# EAGLE design razniffer (EAGLE 6.6.0)
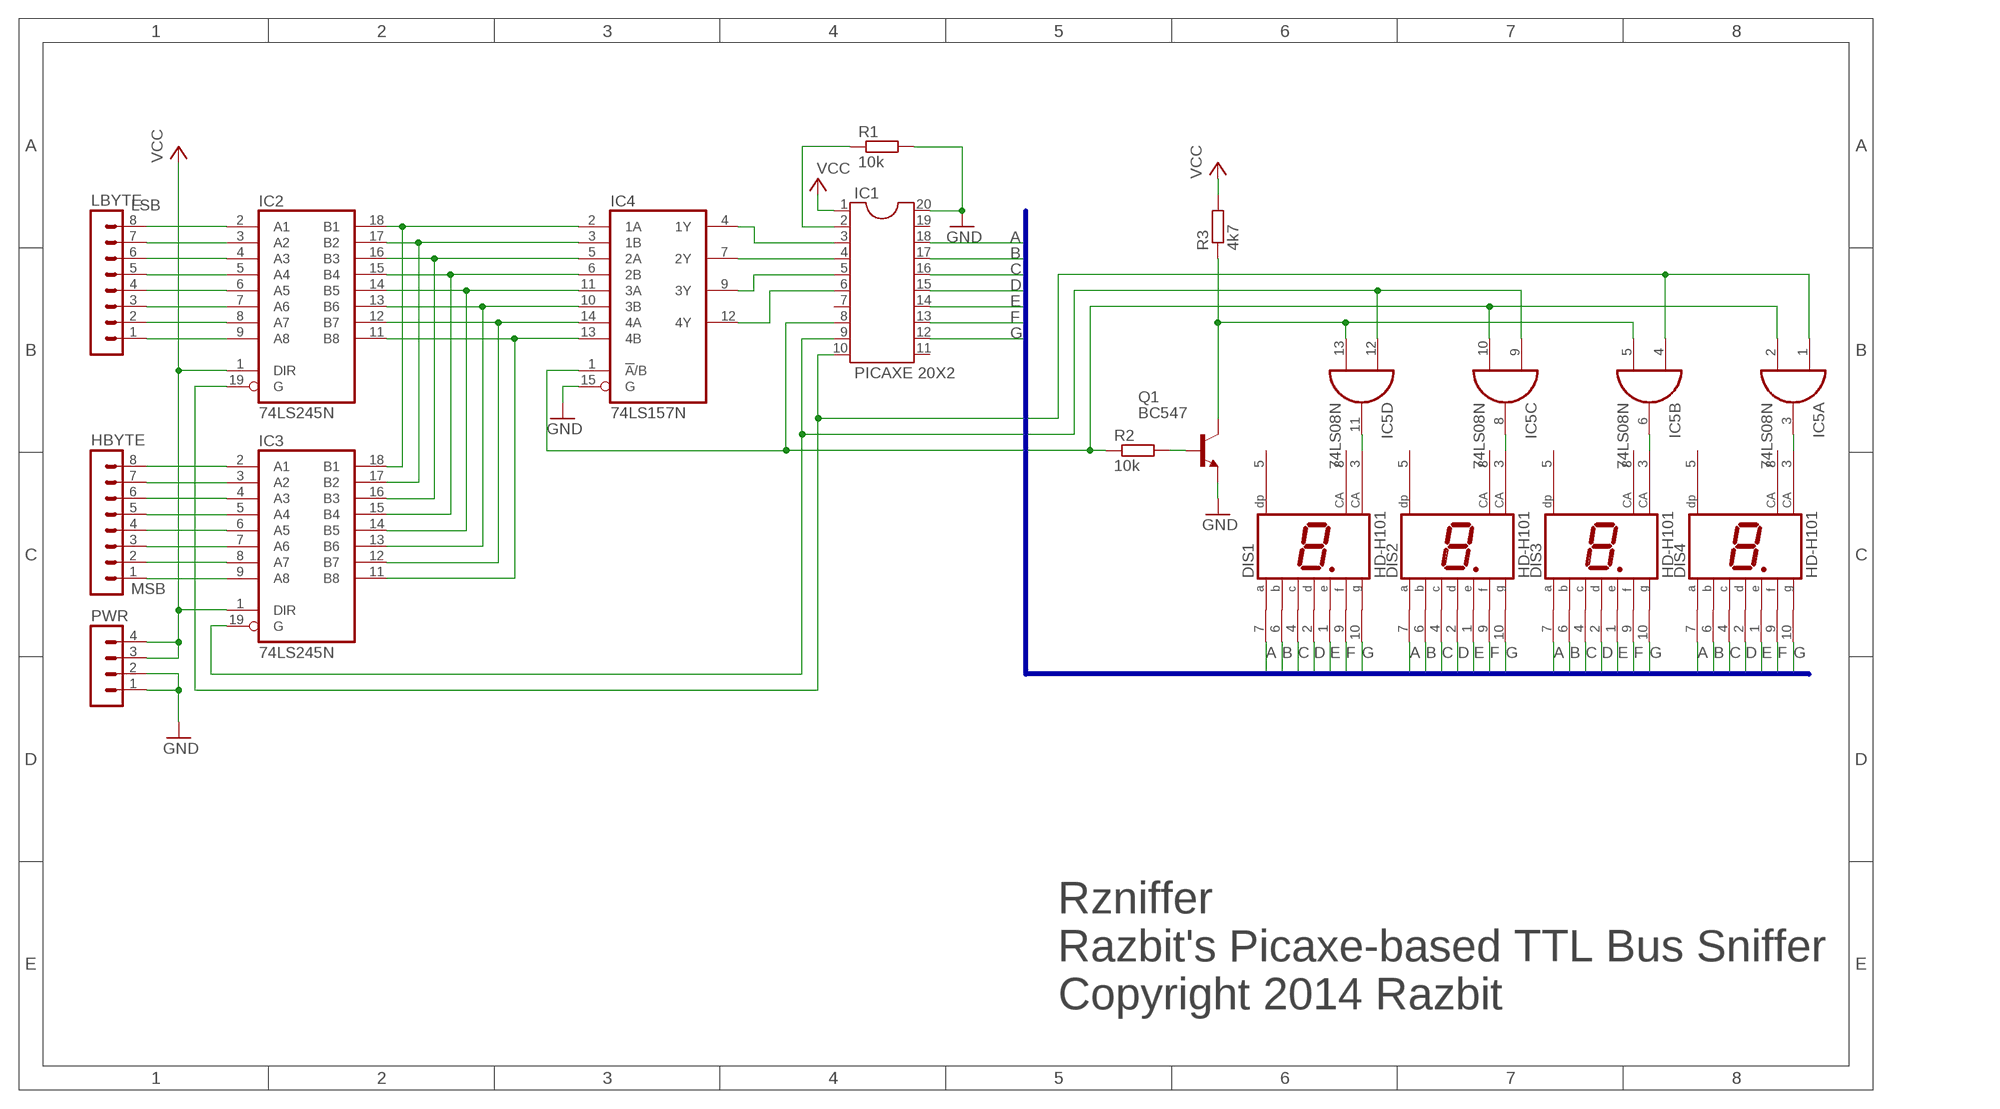
[diagram p0: schematic, sheet 1]

## Parts
DIS1  HD-H101  [HDSP-M]
DIS2  HD-H101  [HDSP-M]
DIS3  HD-H101  [HDSP-M]
DIS4  HD-H101  [HDSP-M]
HBYTE  MA08-1  [MA08-1]
IC1  PICAXE 20X2  DIL20  [DIL20]
IC2  74LS245N  [DIL20]
IC3  74LS245N  [DIL20]
IC4  74LS157N  [DIL16]
IC5  74LS08N  [DIL14]
LBYTE  MA08-1  [MA08-1]
PWR  MA04-1  [MA04-1]
Q1  BC547  [TO92]
R1  10k  R-EU_0204/7  [0204/7]
R2  10k  R-EU_0204/7  [0204/7]
R3  4k7  R-EU_0204/7  [0204/7]

## Nets
A: DIS1.7(A) DIS2.7(A) DIS3.7(A) DIS4.7(A) IC1.18
B: DIS1.6(B) DIS2.6(B) DIS3.6(B) DIS4.6(B) IC1.17
C: DIS1.4(C) DIS2.4(C) DIS3.4(C) DIS4.4(C) IC1.16
D: DIS1.2(D) DIS2.2(D) DIS3.2(D) DIS4.2(D) IC1.15
E: DIS1.1(E) DIS2.1(E) DIS3.1(E) DIS4.1(E) IC1.14
F: DIS1.9(F) DIS2.9(F) DIS3.9(F) DIS4.9(F) IC1.13
G: DIS1.10(G) DIS2.10(G) DIS3.10(G) DIS4.10(G) IC1.12
GND: IC1.20 IC4.15(G) PWR.1 PWR.2 Q1.1(E) R1.2
N$1: IC2.2(A1) LBYTE.8
N$2: IC2.3(A2) LBYTE.7
N$3: IC2.4(A3) LBYTE.6
N$4: IC2.5(A4) LBYTE.5
N$5: IC2.6(A5) LBYTE.4
N$6: IC2.7(A6) LBYTE.3
N$7: IC2.8(A7) LBYTE.2
N$8: IC2.9(A8) LBYTE.1
N$9: HBYTE.8 IC3.2(A1)
N$10: HBYTE.7 IC3.3(A2)
N$11: HBYTE.6 IC3.4(A3)
N$12: HBYTE.5 IC3.5(A4)
N$13: HBYTE.4 IC3.6(A5)
N$14: HBYTE.3 IC3.7(A6)
N$15: HBYTE.2 IC3.8(A7)
N$16: HBYTE.1 IC3.9(A8)
N$17: IC5.5(B:I1) IC5.13(D:I1) Q1.3(C) R3.1
N$18: IC2.18(B1) IC3.18(B1) IC4.2(1A)
N$19: IC2.17(B2) IC3.17(B2) IC4.3(1B)
N$20: IC2.16(B3) IC3.16(B3) IC4.5(2A)
N$21: IC2.15(B4) IC3.15(B4) IC4.6(2B)
N$22: IC2.14(B5) IC3.14(B5) IC4.11(3A)
N$23: IC2.13(B6) IC3.13(B6) IC4.10(3B)
N$24: IC2.12(B7) IC3.12(B7) IC4.14(4A)
N$25: IC2.11(B8) IC3.11(B8) IC4.13(4B)
N$26: Q1.2(B) R2.2
N$27: IC1.2 R1.1
N$28: IC1.3 IC4.4(1Y)
N$29: IC1.4 IC4.7(2Y)
N$30: IC1.5 IC4.9(3Y)
N$31: IC1.6 IC4.12(4Y)
N$32: IC1.10 IC2.19(G) IC5.1(A:I0) IC5.4(B:I0)
N$33: IC1.9 IC3.19(G) IC5.9(C:I0) IC5.12(D:I0)
N$34: IC1.8 IC4.1(!A!/B) IC5.2(A:I1) IC5.10(C:I1) R2.1
N$35: DIS1.3(CA) IC5.11(D:O)
N$36: DIS2.3(CA) IC5.8(C:O)
N$37: DIS3.3(CA) IC5.6(B:O)
N$38: DIS4.3(CA) IC5.3(A:O)
VCC: IC1.1 IC2.1(DIR) IC3.1(DIR) PWR.3 PWR.4 R3.2
Unconnected: DIS1.5(DP) DIS1.8(CA) DIS2.5(DP) DIS2.8(CA) DIS3.5(DP) DIS3.8(CA) DIS4.5(DP) DIS4.8(CA) IC1.7 IC1.11 IC1.19

## Buses
A,B,C,D,E,F,G

## Notes on the sheet
- LSB
- MSB
- Rzniffer
  Razbit's Picaxe-based TTL Bus Sniffer
  Copyright 2014 Razbit

## Power pins joined to a net without a drawn wire
GND: IC2.10(GND) IC3.10(GND) IC4.8(GND) IC5.7(P:GND)
VCC: IC2.20(VCC) IC3.20(VCC) IC4.16(VCC) IC5.14(P:VCC)

## Library data of the parts
DIS1-DIS4 = display-hp:HD-H101: LED DISPLAY 1-character 7 segment, decimal point right; OC_FARNELL: unknown; OC_NEWARK: unknown
HBYTE LBYTE = con-lstb:MA08-1: PIN HEADER; OC_FARNELL: unknown; OC_NEWARK: unknown
IC1 = ic-package:DIL20: Dual In Line / Socket
IC2 IC3 = 74xx-eu:74*245: Octal BUS TRANSCEIVER, 3-state
IC4 = 74xx-eu:74*157: Quadruple 2-line to 1-line data SELECTOR/MULTIPLEXER
IC5 = 74xx-eu:74*08: Quad 2-input AND gate
PWR = con-lstb:MA04-1: PIN HEADER; OC_FARNELL: unknown; OC_NEWARK: unknown
Q1 = transistor-npn:BC547*: NPN Transistor
R1-R3 = resistor:R-EU_: RESISTOR, European symbol

## Board
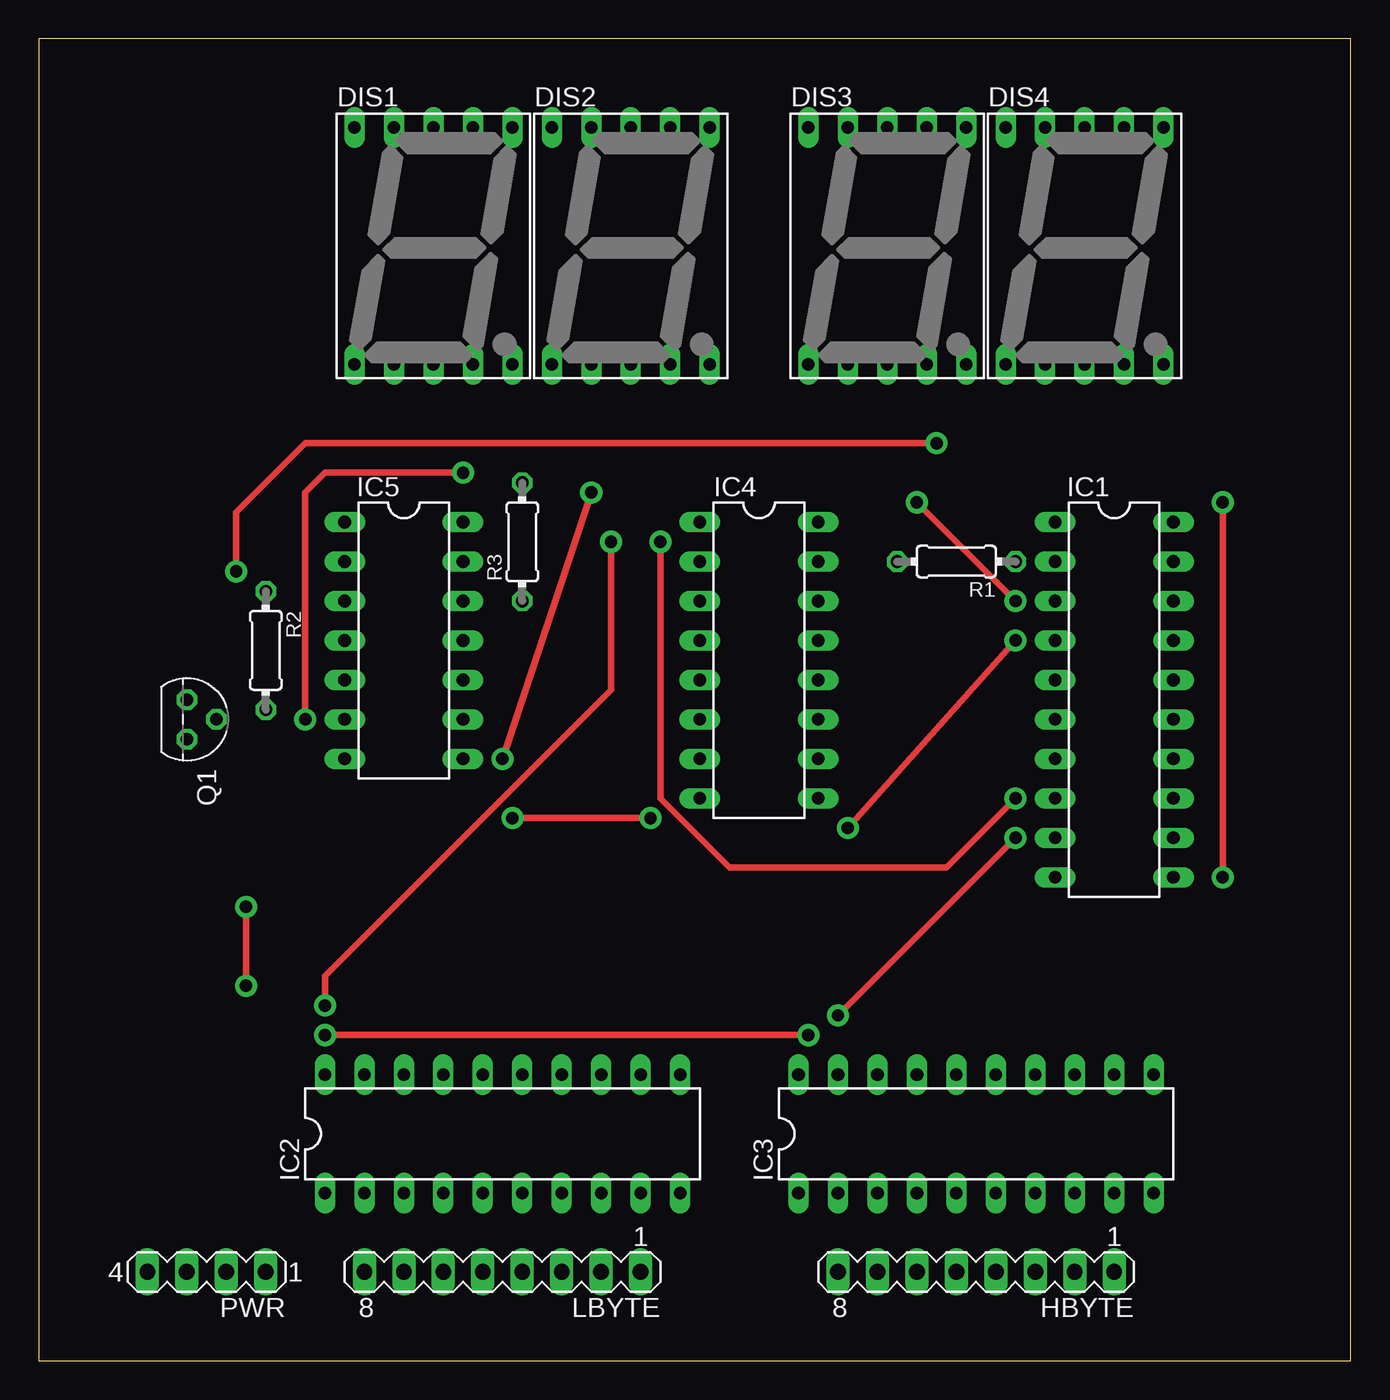
[diagram p1: board, top side]
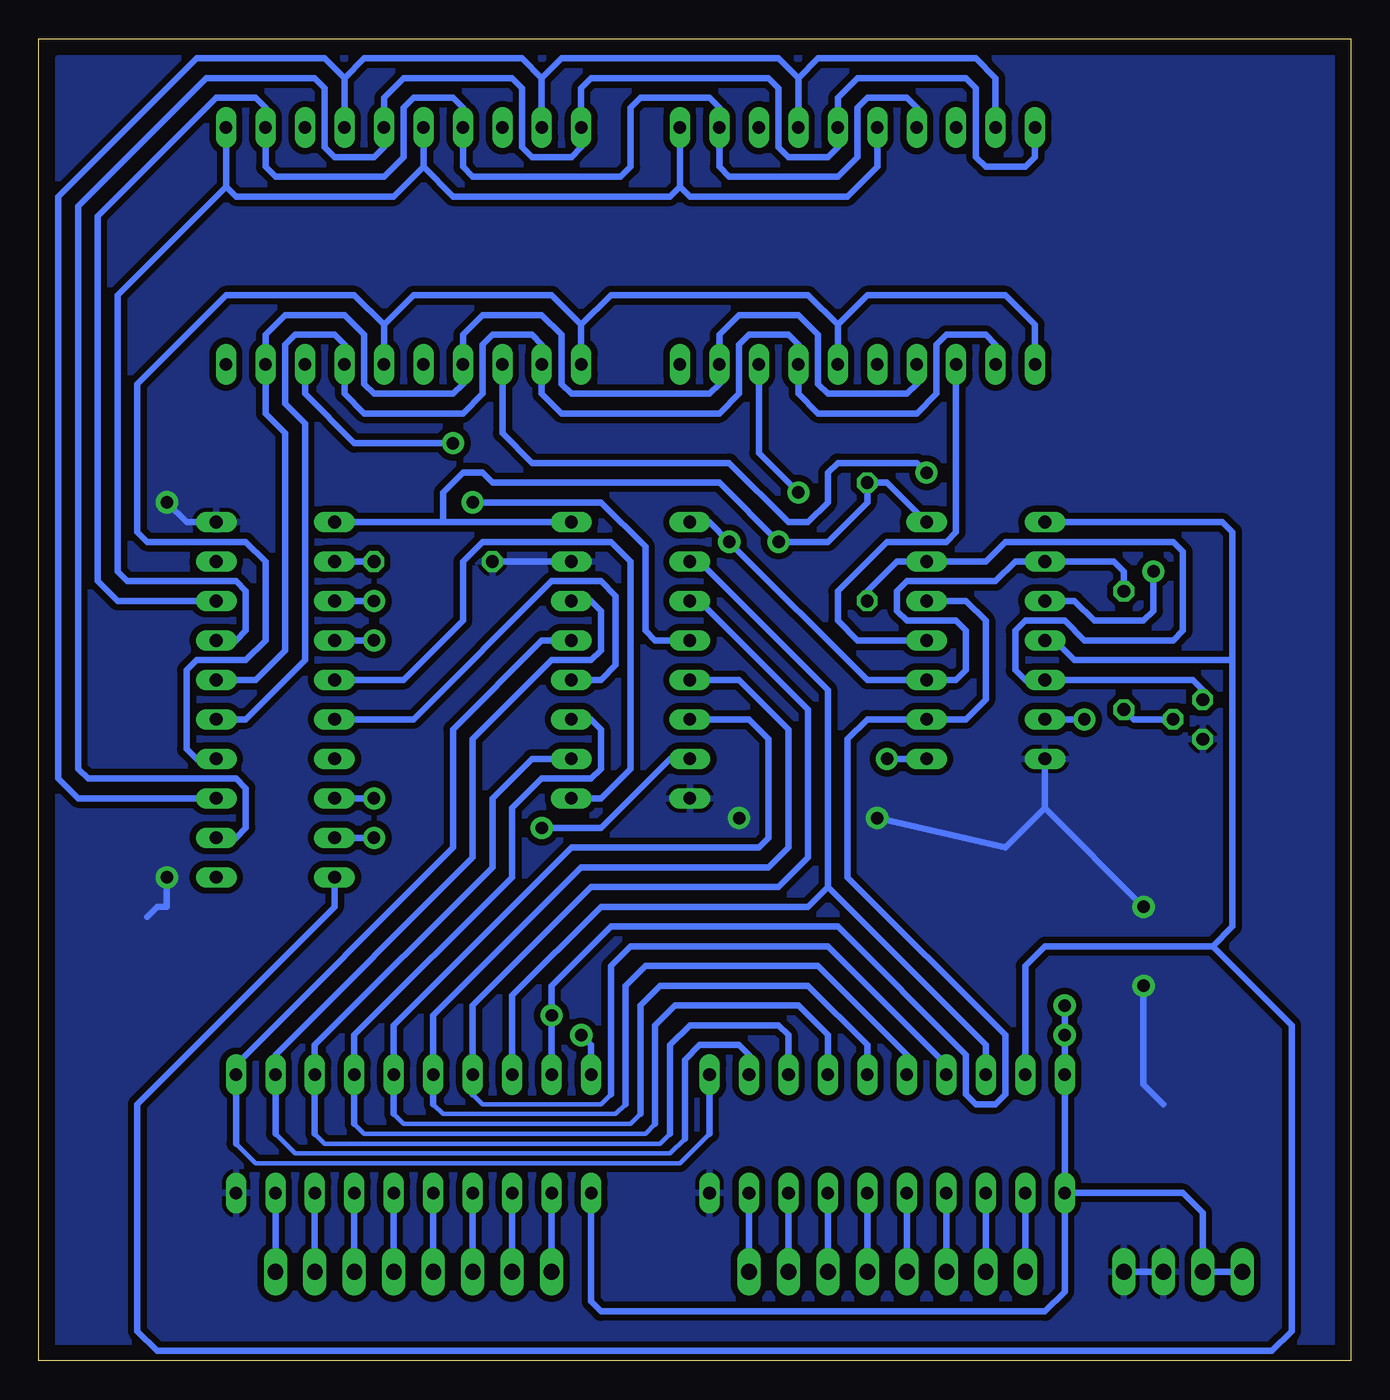
[diagram p2: board, bottom side, seen from below]

Size 84.44 x 85.08 mm. Coordinates in mm from the lower left corner, seen from the top.
Outline: 0,0 84.44,0 84.44,85.08 0,85.08 0,0
Copper layers (1*16): Top 0.035mm / dielectric 1.5mm / Bottom 0.035mm
Design rules "default": minimum track width 10mil, minimum drill 24mil, track to track 8mil, track to pad 8mil, pad to pad 8mil, via to via 8mil, smd to smd 8mil, copper to edge 40mil, drill to drill 8mil, minimum pad ring 10mil, minimum via ring 8mil, stop-mask expansion 4mil, vias tented up to drill 0mil, thermal gap 10mil

### Footprints (pad centres in the part's own frame; a part is rotated, then mirrored left to right if it is on the bottom)
HDSP-M = drill 0.813 long: 1 -5.08,-7.62; 2 -2.54,-7.62; 3 0,-7.62; 4 2.54,-7.62; 5 5.08,-7.62; 6 5.08,7.62; 7 2.54,7.62; 8 0,7.62; 9 -2.54,7.62; 10 -5.08,7.62
MA08-1 = drill 1.016 long: 1 -8.89,0; 2 -6.35,0; 3 -3.81,0; 4 -1.27,0; 5 1.27,0; 6 3.81,0; 7 6.35,0; 8 8.89,0
DIL20 = drill 0.813 long: 1 -11.43,-3.81; 2 -8.89,-3.81; 3 -6.35,-3.81; 4 -3.81,-3.81; 5 -1.27,-3.81; 6 1.27,-3.81; 7 3.81,-3.81; 8 6.35,-3.81; 9 8.89,-3.81; 10 11.43,-3.81; 11 11.43,3.81; 12 8.89,3.81; 13 6.35,3.81; 14 3.81,3.81; 15 1.27,3.81; 16 -1.27,3.81; 17 -3.81,3.81; 18 -6.35,3.81; 19 -8.89,3.81; 20 -11.43,3.81
DIL16 = drill 0.813 long: 1 -8.89,-3.81; 2 -6.35,-3.81; 3 -3.81,-3.81; 4 -1.27,-3.81; 5 1.27,-3.81; 6 3.81,-3.81; 7 6.35,-3.81; 8 8.89,-3.81; 9 8.89,3.81; 10 6.35,3.81; 11 3.81,3.81; 12 1.27,3.81; 13 -1.27,3.81; 14 -3.81,3.81; 15 -6.35,3.81; 16 -8.89,3.81
DIL14 = drill 0.813 long: 1 -7.62,-3.81; 2 -5.08,-3.81; 3 -2.54,-3.81; 4 0,-3.81; 5 2.54,-3.81; 6 5.08,-3.81; 7 7.62,-3.81; 8 7.62,3.81; 9 5.08,3.81; 10 2.54,3.81; 11 0,3.81; 12 -2.54,3.81; 13 -5.08,3.81; 14 -7.62,3.81
MA04-1 = drill 1.016 long: 1 -3.81,0; 2 -1.27,0; 3 1.27,0; 4 3.81,0
TO92 = drill 0.813 octagon: 1 1.27,0; 2 0,1.905; 3 -1.27,0
0204/7 = drill 0.813 octagon: 1 -3.81,0; 2 3.81,0

### Placement (x,y rotation side)
DIS1  25.4,71.76 0 top
DIS2  38.1,71.76 0 top
DIS3  54.61,71.76 0 top
DIS4  67.31,71.76 0 top
HBYTE  60.33,5.71 180 top
IC1  69.22,42.54 270 top
IC2  29.85,14.61 0 top
IC3  60.33,14.61 0 top
IC4  46.36,45.09 270 top
IC5  23.5,46.35 270 top
LBYTE  29.85,5.71 180 top
PWR  10.8,5.71 180 top
Q1  9.52,41.27 270 top
R1  59.05,51.43 180 top
R2  14.61,45.72 270 top
R3  31.11,52.7 90 top

### Tracks (layer width: path | path; a pad name or v marks a point on that pad's centre or on a via)
A
  Bottom 0.406: DIS1.7 27.94,80.65 28.57,81.28 31.11,81.28 31.75,80.65 31.75,77.47 33.02,76.2 40.01,76.2 40.64,76.84 DIS2.7 40.64,80.65 41.28,81.28 45.72,81.28 46.36,80.65 46.36,76.84 46.99,76.2 56.52,76.2 57.15,76.84 DIS3.7 57.15,80.65 57.79,81.28 60.33,81.28 60.96,80.65 60.96,77.47 62.23,76.2 69.22,76.2 69.85,76.84 DIS4.7 69.85,80.65 70.48,81.28 73.03,81.28 80.64,73.66 80.64,50.16 79.38,48.89 IC1.18
B
  Bottom 0.406: DIS4.6 72.39,75.57 | 72.39,75.57 71.76,74.93 61.59,74.93 59.69,76.84 | DIS3.6 59.69,76.84 | 59.69,76.84 57.79,74.93 43.82,74.93 43.18,75.57 | DIS2.6 43.18,75.57 | 43.18,75.57 42.55,74.93 32.39,74.93 30.48,76.84 DIS1.6 | IC1.17 71.76,46.35 71.12,46.99 71.12,49.53 71.76,50.16 78.74,50.16 79.38,50.8 79.38,68.58 72.39,75.57
C
  Bottom 0.406: DIS1.4 27.94,62.86 28.57,62.23 33.66,62.23 34.29,62.86 34.29,66.04 35.56,67.31 39.37,67.31 40.64,66.04 DIS2.4 40.64,62.86 41.28,62.23 50.17,62.23 50.8,62.86 50.8,66.04 52.07,67.31 55.88,67.31 57.15,66.04 DIS3.4 57.15,62.86 57.79,62.23 62.87,62.23 63.5,62.86 63.5,66.04 64.77,67.31 68.58,67.31 69.85,66.04 DIS4.4 69.85,60.96 68.58,59.69 68.58,45.72 70.48,43.81 IC1.16
D
  Bottom 0.406: DIS1.2 22.86,65.41 23.5,66.04 26.04,66.04 26.67,65.41 26.67,62.23 27.94,60.96 34.29,60.96 35.56,62.23 DIS2.2 35.56,65.41 36.2,66.04 38.73,66.04 39.37,65.41 39.37,62.23 40.64,60.96 50.8,60.96 52.07,62.23 DIS3.2 52.07,65.41 52.71,66.04 55.25,66.04 55.88,65.41 55.88,62.23 57.15,60.96 63.5,60.96 64.77,62.23 DIS4.2 64.77,65.41 65.41,66.04 67.95,66.04 68.58,65.41 68.58,61.59 67.31,60.32 67.31,45.09 71.12,41.27 IC1.15
E
  Bottom 0.406: 62.23,66.68 60.33,68.58 51.44,68.58 49.53,66.68 | DIS3.1 49.53,66.68 | 49.53,66.68 47.62,68.58 34.93,68.58 33.02,66.68 | 33.02,66.68 DIS2.1 | DIS1.1 20.32,66.68 22.22,68.58 31.11,68.58 33.02,66.68 | DIS4.1 62.23,66.68 | 62.23,66.68 64.14,68.58 72.39,68.58 78.11,62.86 78.11,53.34 77.47,52.7 71.12,52.7 69.85,51.43 69.85,46.35 71.12,45.09 74.3,45.09 74.93,44.45 74.93,39.37 74.3,38.73 IC1.14
F
  Bottom 0.406: 64.77,82.55 63.5,83.82 53.34,83.82 52.07,82.55 | DIS3.9 52.07,82.55 | 52.07,82.55 50.8,83.82 36.83,83.82 35.56,82.55 | DIS2.9 35.56,82.55 | 35.56,82.55 34.29,83.82 24.13,83.82 22.86,82.55 DIS1.9 | DIS4.9 64.77,82.55 | 64.77,82.55 66.04,83.82 74.3,83.82 83.19,74.93 83.19,37.46 81.92,36.2 IC1.13
G
  Bottom 0.406: DIS1.10 20.32,77.47 20.95,76.84 23.5,76.84 24.13,77.47 24.13,81.92 24.77,82.55 31.75,82.55 33.02,81.28 DIS2.10 33.02,78.11 33.66,77.47 36.2,77.47 36.83,78.11 36.83,81.92 37.47,82.55 48.9,82.55 49.53,81.92 DIS3.10 49.53,78.11 50.17,77.47 52.71,77.47 53.34,78.11 53.34,81.92 53.98,82.55 60.96,82.55 62.23,81.28 DIS4.10 62.23,78.11 62.87,77.47 65.41,77.47 66.04,78.11 66.04,81.92 66.67,82.55 73.66,82.55 81.92,74.3 81.92,38.1 81.28,37.46 71.76,37.46 71.12,36.83 71.12,34.29 71.76,33.66 IC1.12
GND  (via drill 0.8 pad 1.42)
  Top 0.406: v76.2,55.24 v76.2,31.12 | v13.34,29.21 v13.34,24.13 | v39.37,34.92 v30.48,34.92
  Bottom 0.406: PWR.2 PWR.1 | R1.2 IC4.15 | IC1.20 74.93,53.98 v76.2,55.24 | v76.2,31.12 76.2,29.21 76.84,29.21 77.47,28.58 | IC5.7 19.68,35.56 | 19.68,35.56 v13.34,29.21 | v13.34,24.13 13.34,17.78 12.07,16.51 | v30.48,34.92 22.22,33.02 19.68,35.56
  pour Bottom (isolate 0.406): 0.64,83.82 0.64,0.64 83.19,0.64 83.19,83.82
N$1
  Bottom 0.406: LBYTE.8 IC2.2
N$2
  Bottom 0.406: LBYTE.7 IC2.3
N$3
  Bottom 0.406: LBYTE.6 IC2.4
N$4
  Bottom 0.406: LBYTE.5 IC2.5
N$5
  Bottom 0.406: LBYTE.4 IC2.6
N$6
  Bottom 0.406: LBYTE.3 IC2.7
N$7
  Bottom 0.406: LBYTE.2 IC2.8
N$8
  Bottom 0.406: LBYTE.1 IC2.9
N$9
  Bottom 0.406: HBYTE.8 IC3.2
N$10
  Bottom 0.406: HBYTE.7 IC3.3
N$11
  Bottom 0.406: HBYTE.6 IC3.4
N$12
  Bottom 0.406: HBYTE.5 IC3.5
N$13
  Bottom 0.406: HBYTE.4 IC3.6
N$14
  Bottom 0.406: HBYTE.3 IC3.7
N$15
  Bottom 0.406: IC3.8 HBYTE.2
N$16
  Bottom 0.406: HBYTE.1 IC3.9
N$17
  Bottom 0.406: Q1.3 9.52,43.18 10.16,43.81 IC5.5 20.95,43.81 21.59,44.45 21.59,46.99 20.95,47.62 18.41,47.62 17.14,46.35 11.43,46.35 10.8,46.99 10.8,52.07 11.43,52.7 22.22,52.7 23.5,51.43 IC5.13 29.21,51.43 31.11,49.53 R3.1
N$18
  Bottom 0.406: IC3.18 53.98,23.5 48.26,29.21 34.93,29.21 33.66,30.48 | 33.66,30.48 23.5,20.32 IC2.18 | IC4.2 41.91,51.43 33.66,43.18 33.66,30.48
N$19
  Bottom 0.305: 56.52,17.15 55.88,16.51 48.26,16.51 47.62,17.15
  Bottom 0.406: 56.52,17.15 IC3.17 56.52,22.86 48.9,30.48 36.83,30.48 34.93,32.38 34.93,41.91 41.91,48.89 IC4.3 | 47.62,17.15 47.62,25.4 46.36,26.67 33.66,26.67 26.04,19.05 IC2.17
N$20
  Bottom 0.305: 59.05,16.51 58.42,15.88 47.31,15.88 46.67,16.51
  Bottom 0.406: 59.05,16.51 IC3.16 59.05,22.23 49.53,31.75 37.47,31.75 36.2,33.02 36.2,40.64 39.37,43.81 IC4.5 | 46.67,16.51 46.67,24.13 45.4,25.4 34.29,25.4 28.57,19.69 IC2.16
N$21
  Bottom 0.305: 61.59,15.88 60.96,15.24 46.36,15.24 45.72,15.88
  Bottom 0.406: 61.59,15.88 IC3.15 61.59,21.59 50.17,33.02 38.1,33.02 37.47,33.66 37.47,40 38.73,41.27 IC4.6 | 45.72,15.88 45.72,22.86 44.45,24.13 34.93,24.13 31.11,20.32 IC2.15
N$22
  Bottom 0.305: 64.14,15.24 63.5,14.61 45.4,14.61 44.77,15.24
  Bottom 0.406: 64.14,15.24 IC3.14 64.14,20.96 53.98,31.12 53.98,35.56 52.07,37.46 48.9,37.46 48.26,38.1 48.26,40.64 48.9,41.27 IC4.11 | 44.77,15.24 44.77,21.59 43.5,22.86 35.56,22.86 33.66,20.96 IC2.14
N$23
  Bottom 0.305: 66.67,14.61 66.04,13.97 44.45,13.97 43.82,14.61
  Bottom 0.406: 66.67,14.61 IC3.13 66.67,20.32 55.25,31.75 55.25,36.2 52.71,38.73 IC4.10 | 43.82,14.61 43.82,20.32 42.55,21.59 36.83,21.59 36.2,20.96 IC2.13
N$24
  Bottom 0.305: 69.22,14.61 67.95,13.33 43.82,13.33 42.86,14.29
  Bottom 0.406: 69.22,14.61 IC3.12 69.22,19.69 56.52,32.38 56.52,40 51.44,45.09 48.9,45.09 48.26,45.72 48.26,48.26 48.9,48.89 IC4.14 | 42.86,14.29 42.86,19.37 41.91,20.32 39.37,20.32 38.73,19.69 IC2.12
N$25
  Bottom 0.305: 71.76,13.97 70.48,12.7 43.18,12.7 41.28,14.61
  Bottom 0.406: 71.76,13.97 IC3.11 71.76,19.05 57.79,33.02 57.79,40.64 52.07,46.35 IC4.13 | 41.28,14.61 IC2.11
N$26
  Bottom 0.406: R2.2 13.97,41.27 Q1.2
N$27
  Bottom 0.406: R1.1 IC1.2
N$28  (via drill 0.8 pad 1.42)
  Top 0.406: v56.52,55.24 v62.87,48.89
  Bottom 0.406: IC4.4 44.77,46.35 45.4,46.99 45.4,52.39 48.26,55.24 v56.52,55.24 | v62.87,48.89 IC1.3
N$29  (via drill 0.8 pad 1.42)
  Top 0.406: v52.07,34.29 v62.87,46.35
  Bottom 0.406: IC4.7 43.82,38.73 48.26,34.29 v52.07,34.29 | v62.87,46.35 IC1.4
N$30
  Bottom 0.406: IC4.9 48.26,36.2 46.36,38.1 46.36,51.43 47.62,52.7 55.88,52.7 57.15,51.43 57.15,47.62 60.96,43.81 IC1.5
N$31
  Bottom 0.406: IC4.12 48.26,43.81 47.31,44.77 47.31,49.21 48.26,50.16 51.44,50.16 60.33,41.27 IC1.6
N$32
  Bottom 0.406: IC5.4 19.05,46.35 17.78,45.09 7.62,45.09 | 7.62,45.09 7.62,53.34 8.25,53.98 IC5.1 | 7.62,45.09 7.62,27.94 8.89,26.67 | 8.89,26.67 19.68,26.67 20.95,25.4 IC2.19 | IC1.10 65.41,29.21 78.11,16.51 78.11,1.91 76.84,0.64 5.08,0.64 3.81,1.91 3.81,21.59 8.89,26.67
N$33  (via drill 0.8 pad 1.42)
  Top 0.406: v62.87,33.66 v51.44,22.23
  Bottom 0.406: IC5.12 24.77,48.89 23.5,47.62 23.5,42.54 24.77,41.27 IC5.9 31.11,41.27 32.39,40 32.39,31.12 22.22,20.96 22.22,17.15 22.86,16.51 24.13,16.51 24.77,17.15 24.77,19.69 33.02,27.94 47.62,27.94 51.44,24.13 v51.44,22.23 IC3.19 | IC1.9 v62.87,33.66
N$34  (via drill 0.8 pad 1.42)
  Top 0.406: v40.01,52.7 40.01,36.2 44.45,31.75 58.42,31.75 v62.87,36.2
  Bottom 0.406: R2.1 14.61,50.8 15.24,51.43 IC5.2 21.59,51.43 22.86,50.16 28.57,50.16 29.21,49.53 29.21,48.26 28.57,47.62 25.4,47.62 24.77,46.99 24.77,44.45 25.4,43.81 IC5.10 31.11,43.81 v40.01,52.7 41.28,53.98 IC4.1 | v62.87,36.2 IC1.8
N$35
  Bottom 0.406: DIS1.3 25.4,53.34 26.04,52.7 29.85,52.7 33.02,49.53 33.02,47.62 31.75,46.35 IC5.11
N$36  (via drill 0.8 pad 1.42)
  Top 0.406: v35.56,55.88 v29.85,38.73
  Bottom 0.406: DIS2.3 38.1,58.42 v35.56,55.88 | v29.85,38.73 IC5.8
N$37  (via drill 0.8 pad 1.42)
  Top 0.406: v27.3,57.15 18.41,57.15 17.14,55.88 v17.14,41.27
  Bottom 0.406: DIS3.3 54.61,59.69 52.71,57.78 40.01,57.78 36.2,53.98 34.93,53.98 33.66,55.24 33.66,57.15 33.02,57.78 27.94,57.78 v27.3,57.15 | v17.14,41.27 IC5.6
N$38  (via drill 0.8 pad 1.42)
  Top 0.406: v12.7,50.8 12.7,54.61 17.14,59.05 v57.79,59.05
  Bottom 0.406: IC5.3 17.78,48.89 16.51,47.62 13.34,47.62 12.7,48.26 v12.7,50.8 | v57.79,59.05 64.14,59.05 67.31,62.23 DIS4.3
VCC  (via drill 0.8 pad 1.42)
  Top 0.406: v49.53,20.96 v18.41,20.96 | v36.83,52.7 36.83,43.18 18.41,24.77 v18.41,22.86
  Bottom 0.406: IC1.1 58.42,53.98 | 58.42,53.98 IC4.16 | PWR.4 PWR.3 9.52,9.53 10.8,10.79 IC2.1 | IC2.1 IC2.20 v18.41,20.96 v18.41,22.86 | IC2.1 18.41,4.45 19.68,3.17 48.26,3.17 48.9,3.81 IC3.1 | IC5.14 29.85,56.52 R3.2 31.11,55.24 33.66,52.7 v36.83,52.7 40.64,56.52 55.25,56.52 55.88,57.15 57.15,57.15 58.42,55.88 58.42,53.98 | IC3.20 48.9,20.32 v49.53,20.96